# EAGLE design Color-LCD-Shield (EAGLE 6.5.0)
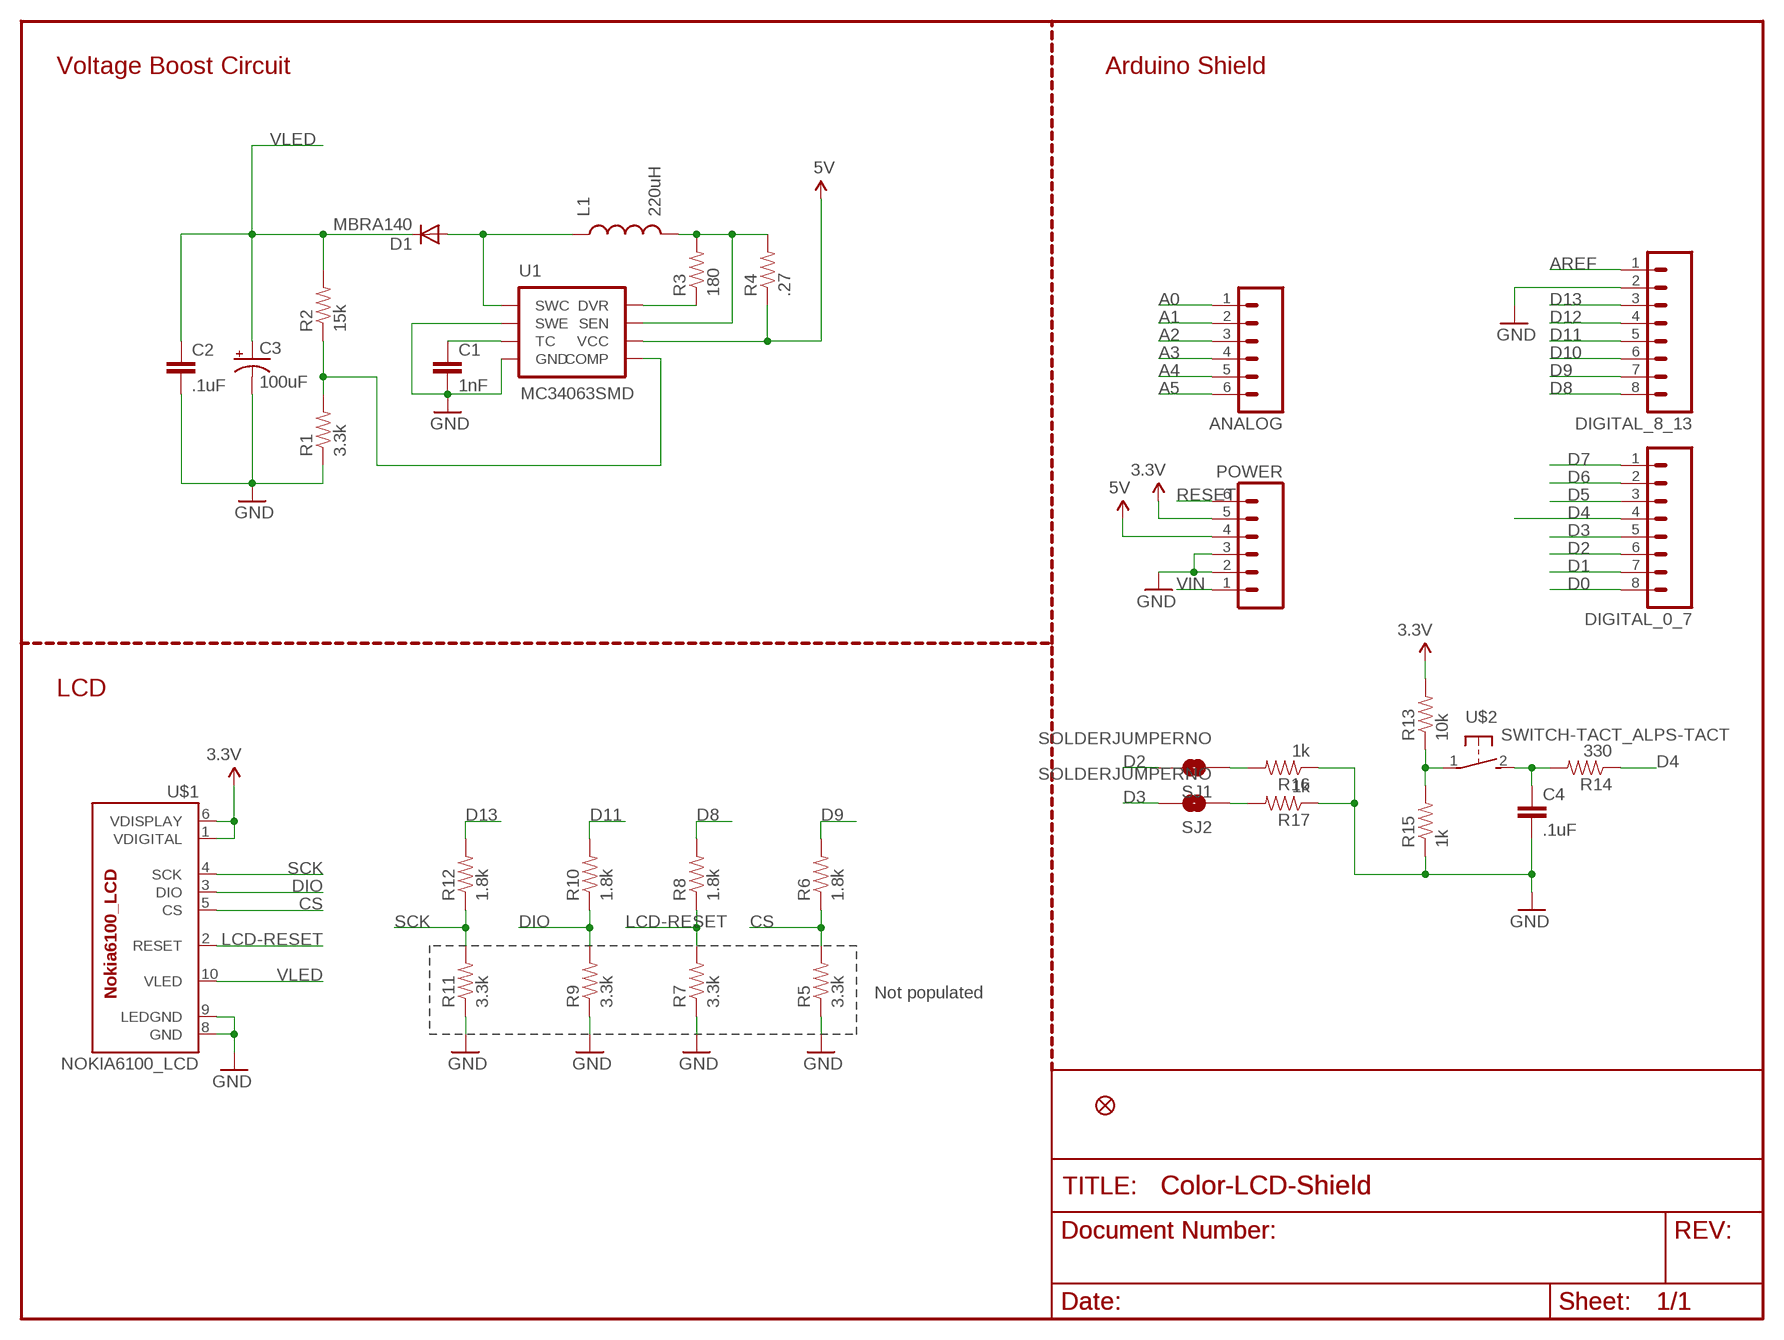
[diagram p0: schematic, sheet 1]

## Parts
ANALOG  M06SIP  [1X06]
C1  1nF  CAP0603-CAP  [0603-CAP]
C2  .1uF  CAP0603-CAP  [0603-CAP]
C3  100uF  CAP_POL7343  [EIA7343]
C4  .1uF  CAP0603-CAP  [0603-CAP]
D1  MBRA140  DIODESMA  [SMA-DIODE]
DIGITAL_0_7  M08  [1X08]
DIGITAL_8_13  M08  [1X08]
JP2  FIDUCIAL1X2  [FIDUCIAL-1X2]
L1  220uH  INDUCTORNPI75C  [NPI75C]
POWER  M06SIP  [1X06]
R1  3.3k  RESISTOR0603-RES  [0603-RES]
R2  15k  RESISTOR0603-RES  [0603-RES]
R3  180  RESISTOR0603-RES  [0603-RES]
R4  .27  RESISTOR0603-RES  [0603-RES]
R5  3.3k  RESISTOR0603-RES  [0603-RES]
R6  1.8k  RESISTOR0603-RES  [0603-RES]
R7  3.3k  RESISTOR0603-RES  [0603-RES]
R8  1.8k  RESISTOR0603-RES  [0603-RES]
R9  3.3k  RESISTOR0603-RES  [0603-RES]
R10  1.8k  RESISTOR0603-RES  [0603-RES]
R11  3.3k  RESISTOR0603-RES  [0603-RES]
R12  1.8k  RESISTOR0603-RES  [0603-RES]
R13  10k  RESISTOR0603-RES  [0603-RES]
R14  330  RESISTOR0603-RES  [0603-RES]
R15  1k  RESISTOR0603-RES  [0603-RES]
R16  1k  RESISTOR0603-RES  [0603-RES]
R17  1k  RESISTOR0603-RES  [0603-RES]
SJ1  SOLDERJUMPERNO  [SJ_2S-NO]
SJ2  SOLDERJUMPERNO  [SJ_2S-NO]
U1  MC34063SMD  [SO08]
U$1  NOKIA6100_LCD  [NOKIA6100_LCD]
U$2  SWITCH-TACT_ALPS-TACT  [SWITCH-TACT_DTS-6]

## Nets
3.3V: POWER.5 R13.2 U$1.1(VDIGITAL) U$1.6(VDISPLAY)
5V: POWER.4 R4.1 U1.6(VCC)
A0: ANALOG.1
A1: ANALOG.2
A2: ANALOG.3
A3: ANALOG.4
A4: ANALOG.5
A5: ANALOG.6
AREF: DIGITAL_8_13.1
CS: R5.2 R6.1 U$1.5(CS)
D0: DIGITAL_0_7.8
D1: DIGITAL_0_7.7
D2: DIGITAL_0_7.6 SJ1.2
D3: DIGITAL_0_7.5 SJ2.2
D4: DIGITAL_0_7.4 R14.1
D5: DIGITAL_0_7.3
D6: DIGITAL_0_7.2
D7: DIGITAL_0_7.1
D8: DIGITAL_8_13.8 R8.2
D9: DIGITAL_8_13.7 R6.2
D10: DIGITAL_8_13.6
D11: DIGITAL_8_13.5 R10.2
D12: DIGITAL_8_13.4
D13: DIGITAL_8_13.3 R12.2
DIO: R9.2 R10.1 U$1.3(DIO)
GND: C1.2 C2.2 C3.C(-) C4.2 DIGITAL_8_13.2 POWER.2 POWER.3 R1.1 R5.1 R7.1 R9.1 R11.1 R15.1 R16.1 R17.1 U1.2(SWE) U1.4(GND) U$1.8(GND) U$1.9(LEDGND)
LCD-RESET: R7.2 R8.1 U$1.2(RESET)
N$1: R13.1 R15.2 U$2.1
N$2: C4.1 R14.2 U$2.2
N$5: R17.2 SJ2.1
N$6: R16.2 SJ1.1
N$9: R1.2 R2.1 U1.5(COMP)
N$10: C1.1 U1.3(TC)
N$13: D1.A L1.1 U1.1(SWC)
N$14: R3.1 U1.8(DVR)
N$15: L1.2 R3.2 R4.2 U1.7(SEN)
RESET: POWER.6
SCK: R11.2 R12.1 U$1.4(SCK)
VIN: POWER.1
VLED: C2.1 C3.A(+) D1.C R2.2 U$1.10(VLED)

## Notes on the sheet
- Voltage Boost Circuit | Arduino Shield
- LCD
- Not populated

## Library data of the parts
ANALOG POWER = SparkFun:M06: Header 6 Standard 6-pin 0.1" header. Use with straight break away headers (SKU : PRT-00116), right angle break away headers (PRT-00553), swiss pins (PRT-00743), machine pins (PRT-00117), and female headers (PRT-00115). Molex polarized connector foot print use with SKU : PRT-08094 with associated crimp pins and housings. NOTES ON THE VARIANTS LOCK and LOCK_LONGPADS... This footprint was designed to help hold the alignment of a through-hole component (i.e. 6-pin header) while soldering it into place. You may notice that each hole has been shifted either up or down by 0.005 of an inch from it's more standard position (which is a perfectly straight line). This slight alteration caused the pins (the squares in the middle) to touch the edges of the holes. Because they are alternating, it causes a "brace" to hold the component in place. 0.005 has proven to be the perfect amount of "off-center" position when using our standard breakaway headers. Although looks a little odd when you look at the bare footprint, once you have a header in there, the alteration is very hard to notice. Also, if you push a header all the way into place, it is covered up entirely on the bottom side. This idea of altering the position of holes to aid alignment will be further integrated into the Sparkfun Library for other footprints. It can help hold any component with 3 or more connection pins.
C1 C2 C4 = SparkFun:CAP: Capacitor Standard 0603 ceramic capacitor, and 0.1" leaded capacitor.
C3 = SparkFun:CAP_POL: Capacitor Polarized These are standard SMD and PTH capacitors. Normally 10uF, 47uF, and 100uF in electrolytic and tantalum varieties. Always verify the external diameter of the through hole cap, it varies with capacity, voltage, and manufacturer. The EIA devices should be standard.
D1 = SparkFun:DIODE: Diode These are standard reverse protection diodes and small signal diodes. SMA package can handle up to about 1A. SOD-323 can handle about 200mA. What the SOD-323 package when ordering, there are some mfgs out there that are 5-pin packages.
DIGITAL_0_7 DIGITAL_8_13 = SparkFun:M08: Header 8 Standard 8-pin 0.1" header. Use with straight break away headers (SKU : PRT-00116), right angle break away headers (PRT-00553), swiss pins (PRT-00743), machine pins (PRT-00117), and female headers (PRT-00115).
JP2 = SparkFun:FIDUCIAL: Fiducial Alignment Points Various fiducial points for machine vision alignment.
L1 = SparkFun:INDUCTOR: Inductors Basic Inductor/Choke - 0603 and 1206. Footprints are not proven and vary greatly between part numbers.
R1-R17 = SparkFun:RESISTOR: Resistor Basic schematic elements and footprints for 0603, 1206, and PTH resistors.
SJ1 SJ2 = SparkFun-Passives:SOLDERJUMPER: Solder Jumper Standard SMD solder jumper. Used to automate production. Two varients : Normally Open and Normally Closed are the same, but have different paste layers. NC will have a large amount of paste and should jumper during reflow.
U1 = SparkFun:MC34063
U$1 = SparkFun:NOKIA6100_LCD: Nokia 6100 Color LCD Schematic element and footprint production proven but could use some touching up. Spark Fun Electronics SKU : LCD-00569. Mating SMD connector : LCD-00570
U$2 = Maple-mini-r2-evolution-board.td:SWITCH-TACT_ALPS-TACT

## Board
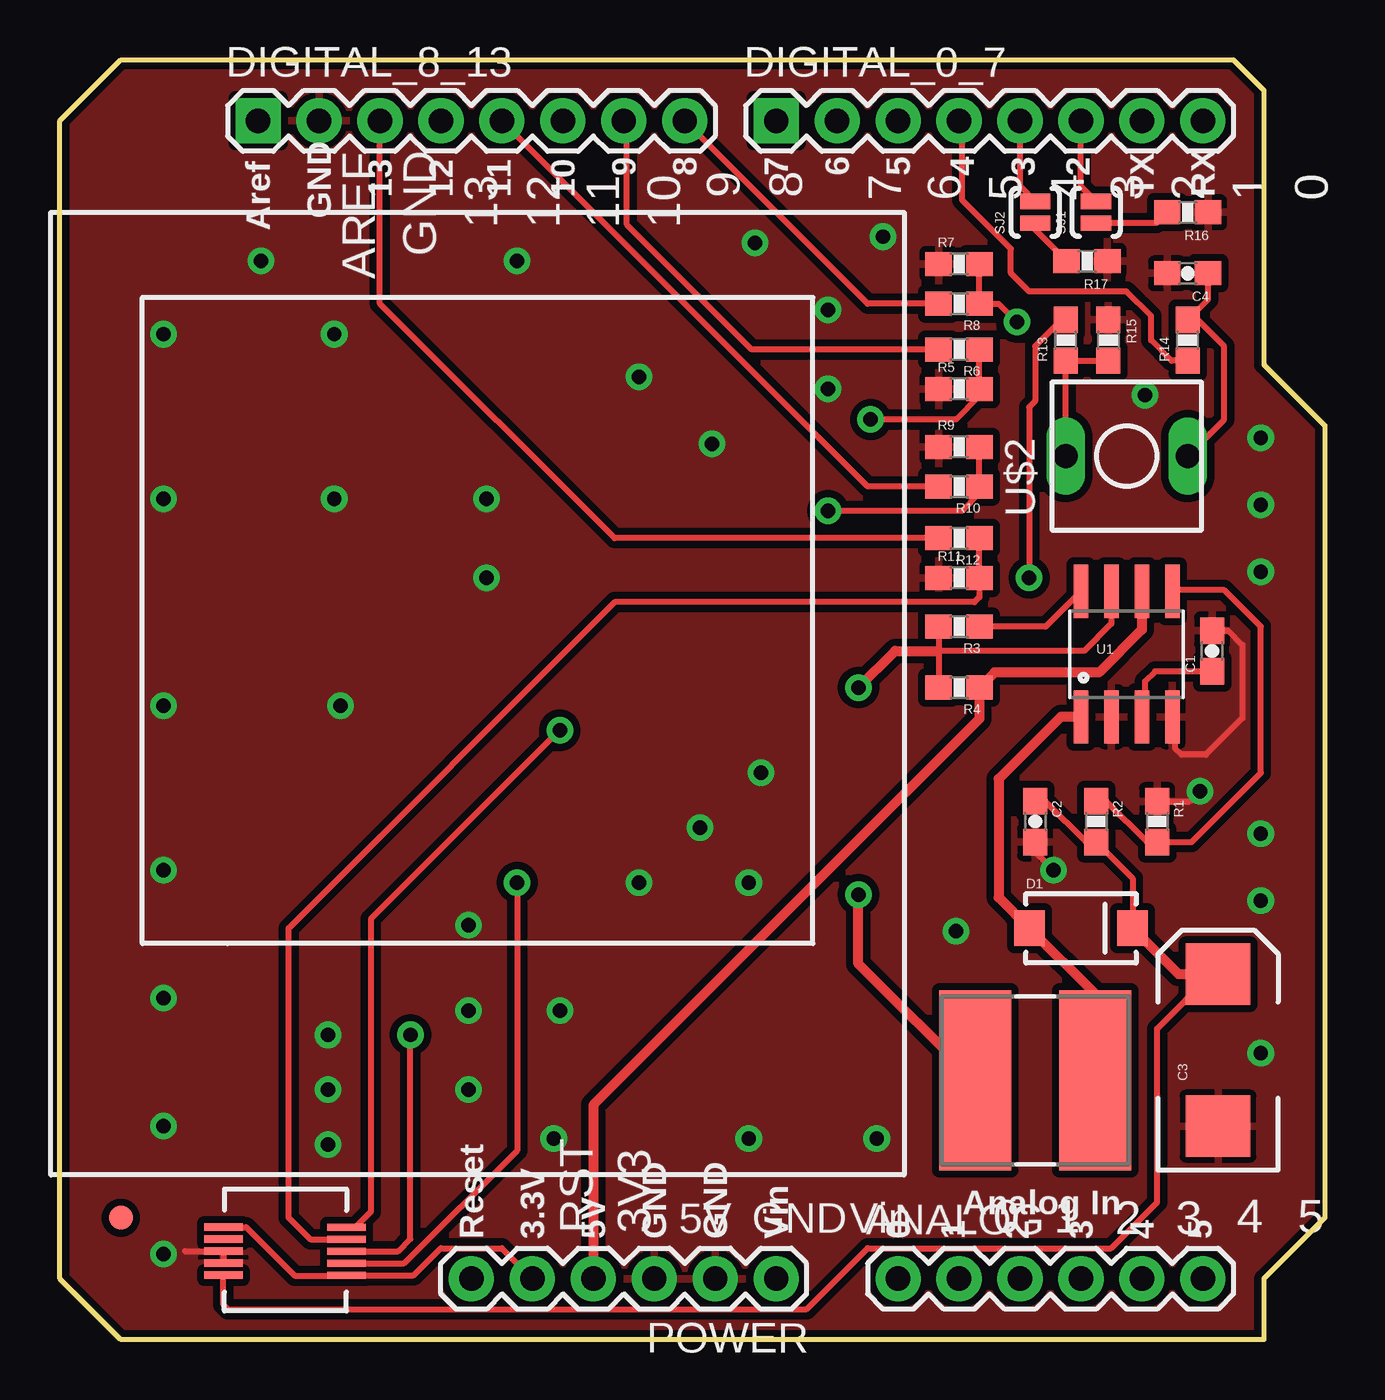
[diagram p1: board, top side]
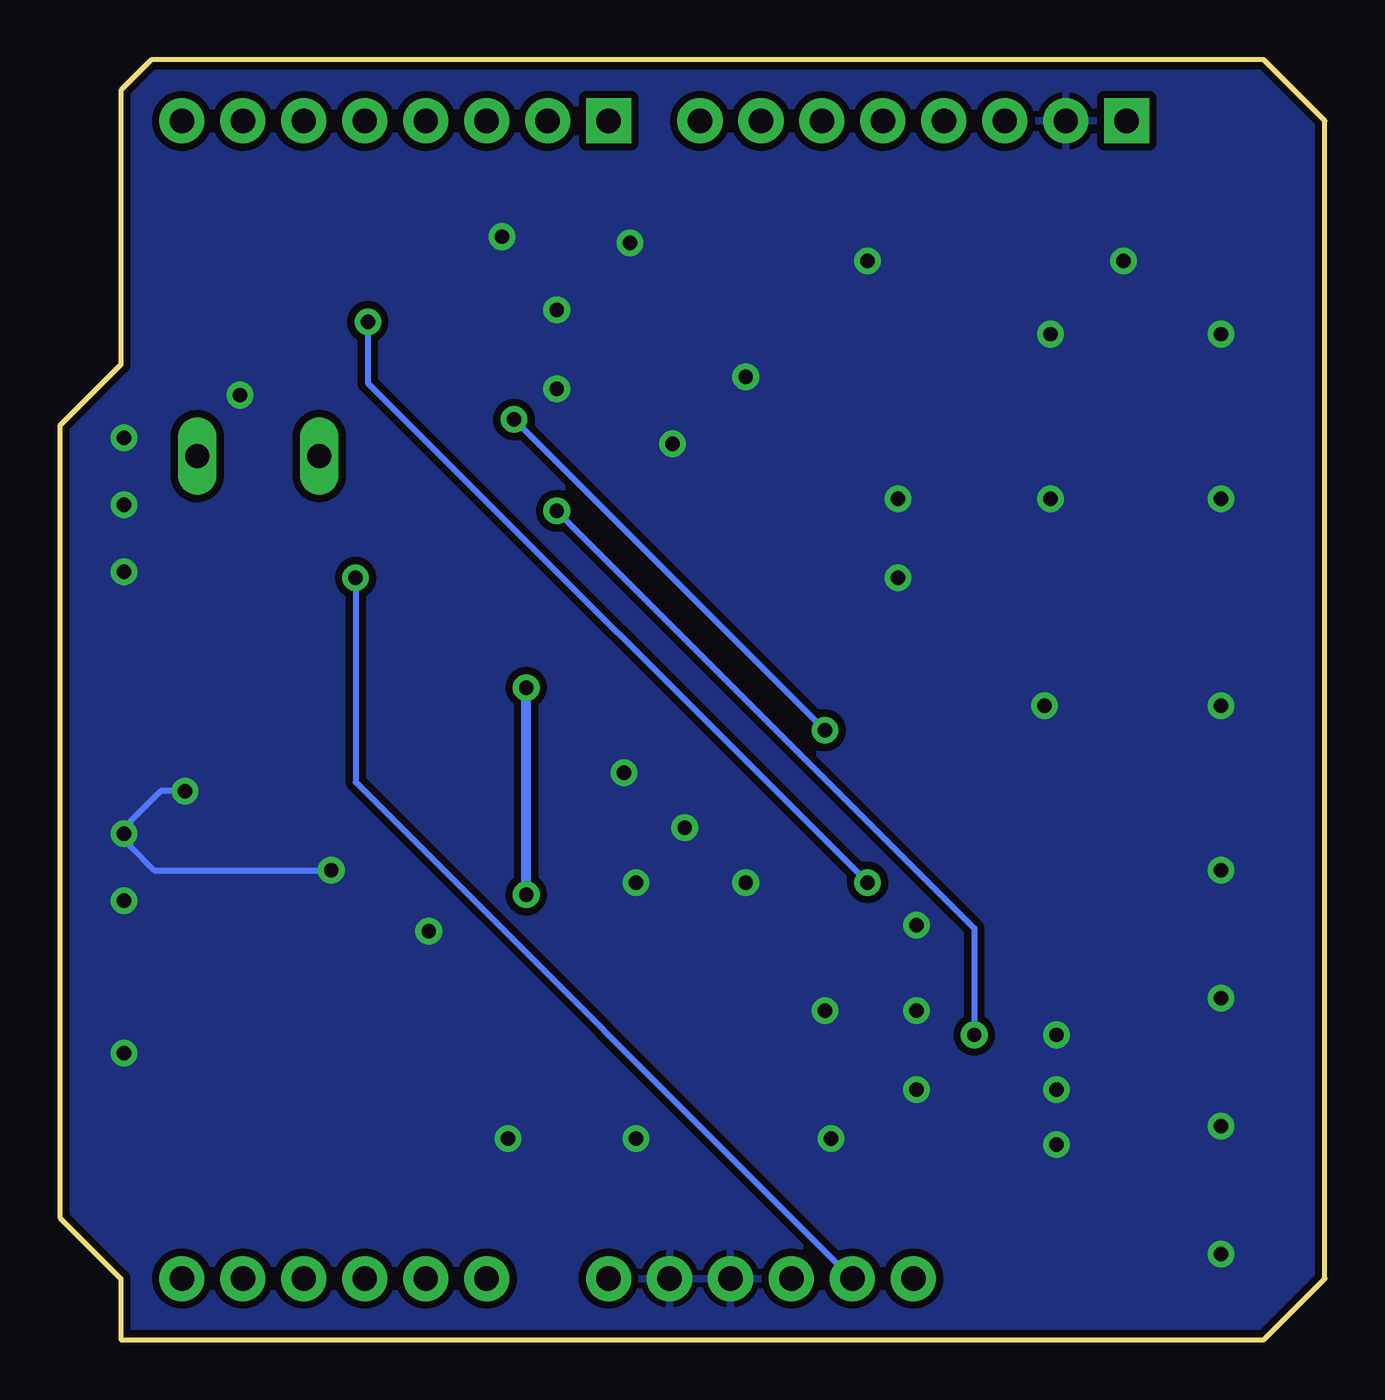
[diagram p2: board, bottom side, seen from below]

Size 52.7 x 53.34 mm. Coordinates in mm from the lower left corner, seen from the top.
Outline: 2.54,0 0,2.54 0,50.8 2.54,53.34 48.9,53.34 50.16,52.07 50.16,40.64 52.7,38.1 52.7,5.08 50.16,2.54 50.16,0 2.54,0
Copper layers (1*16): Top 0.035mm / dielectric 1.5mm / Bottom 0.035mm
Design rules "SparkFun-2-layer": minimum track width 7mil, minimum drill 15mil, track to track 8mil, track to pad 8mil, pad to pad 8mil, via to via 8mil, smd to smd 8mil, copper to edge 8mil, drill to drill 8mil, minimum pad ring 12mil, minimum via ring 10mil, stop-mask expansion 4mil, vias tented up to drill 20mil, thermal gap 10mil

### Footprints (pad centres in the part's own frame; a part is rotated, then mirrored left to right if it is on the bottom)
1X06 = drill 1.016 pad 1.88: 1 0,0; 2 2.54,0; 3 5.08,0; 4 7.62,0; 5 10.16,0; 6 12.7,0
0603-CAP = smd 1.1 x 1: 1 -0.85,0; 2 0.85,0
EIA7343 = smd 2.55 x 2.7: A 3.17,0; C -3.17,0
SMA-DIODE = smd 1.27 x 1.47: A -2.15,0; C 2.15,0
1X08 = drill 1.016 pad 1.88 square: 1 0,0 | drill 1.016 pad 1.88: 2 2.54,0; 3 5.08,0; 4 7.62,0; 5 10.16,0; 6 12.7,0; 7 15.24,0; 8 17.78,0
FIDUCIAL-1X2 = smd 1 x 1: 1 0,0
NPI75C = smd 3 x 7.5: 1 -2.5,0; 2 2.5,0
0603-RES = smd 1.1 x 1: 1 -0.85,0; 2 0.85,0
SJ_2S-NO = smd 0.635 x 1.27: 1 -0.45,0; 2 0.45,0
SO08 = smd 0.61 x 2.21: 1 -1.905,-2.616; 2 -0.635,-2.616; 3 0.635,-2.616; 4 1.905,-2.616; 5 1.905,2.616; 6 0.635,2.616; 7 -0.635,2.616; 8 -1.905,2.616
NOKIA6100_LCD = smd 1.6 x 0.3: 1 24.255,44.311; 2 24.255,43.811; 3 24.255,43.311; 4 24.255,42.811; 5 24.255,42.311; 6 29.389,42.303; 7 29.389,42.803; 8 29.389,43.303; 9 29.389,43.803; 10 29.389,44.303
SWITCH-TACT_DTS-6 = drill 1 long: 1 0,2.54; 2 0,-2.54

### Placement (x,y rotation side)
ANALOG  34.92,2.54 0 top
C1  48.01,28.7 90 top
C2  40.64,21.59 270 top
C3  48.26,12.06 90 top
C4  46.99,44.45 180 top
D1  42.55,17.14 0 top
DIGITAL_0_7  29.84,50.8 0 top
DIGITAL_8_13  8.26,50.8 0 top
JP2  2.54,5.08 0 top
L1  40.64,10.79 180 top
POWER  29.84,2.54 180 top
R1  45.72,21.59 270 top
R2  43.18,21.59 270 top
R3  37.47,29.72 180 top
R4  37.47,27.18 180 top
R5  37.47,39.62 0 top
R6  37.47,41.27 180 top
R7  37.47,44.83 0 top
R8  37.47,43.18 180 top
R9  37.47,37.21 0 top
R10  37.47,35.56 180 top
R11  37.47,31.75 0 top
R12  37.47,33.4 180 top
R13  41.91,41.66 90 top
R14  46.99,41.66 90 top
R15  43.69,41.66 270 top
R16  46.99,46.99 180 top
R17  42.8,44.96 180 top
SJ1  43.18,46.99 90 top
SJ2  40.64,46.99 90 top
U1  44.45,28.57 0 top
U$1  36.2,46.99 180 top
U$2  44.45,36.83 90 top

### Tracks (layer width: path | path; a pad name or v marks a point on that pad's centre or on a via)
3.3V  (via drill 0.6 pad 0.25)
  Top 0.254: U$1.6 7.76,4.69 9.78,2.67 11.43,2.67 11.44,2.68 U$1.1 14.74,2.68 15.88,3.81 18.41,3.81 POWER.5 | R13.2 41.74,42.51 40.64,41.4 40.64,39.12 40.39,38.86 v40.39,31.75
  Bottom 0.254: v40.39,31.75 40.39,23.24 POWER.5
5V
  Top 0.406: U1.6 45.09,29.59 43.31,27.81 38.95,27.81 R4.1 38.31,25.87 22.23,9.78 POWER.4
CS  (via drill 0.6 pad 0.25)
  Top 0.254: R6.1 R5.2 38.31,39.33 37.34,38.35 v33.78,38.35 | v20.83,25.4 12.95,17.53 12.95,5.33 12.3,4.68 U$1.5
  Bottom 0.254: v33.78,38.35 v20.83,25.4
D2
  Top 0.254: SJ1.2 42.55,48.08 DIGITAL_0_7.6
D3
  Top 0.254: SJ2.2 40.01,48.08 DIGITAL_0_7.5
D4
  Top 0.254: R14.1 46.32,40.81 45.47,41.66 45.47,42.67 44.45,43.69 40.39,43.69 39.62,44.45 39.62,45.47 37.59,47.5 37.59,50.67 DIGITAL_0_7.4
D8
  Top 0.254: R8.2 33.66,43.18 DIGITAL_8_13.8
D9
  Top 0.254: R6.2 28.83,41.27 23.62,46.48 23.62,50.67 DIGITAL_8_13.7
D11
  Top 0.254: R10.2 33.66,35.56 DIGITAL_8_13.5
D13
  Top 0.254: R12.2 23.11,33.4 13.34,43.18 DIGITAL_8_13.3
DIO  (via drill 0.6, 0.6 pad 0.25)
  Top 0.254: U$1.3 14.09,3.68 14.61,4.19 v14.61,12.7 | R9.2 R10.1 38.31,35.27 37.59,34.54 v32,34.54
  Bottom 0.254: v32,34.54 14.61,17.14 v14.61,12.7
GND  (via drill 0.6)
  Top 0.254: 5.21,3.68 5.21,3.69 U$1.8 U$1.9 | C1.2 48.68,29.55 49.28,28.96 49.28,25.91 47.75,24.38 46.74,24.38 46.48,24.64 46.48,25.83 U1.4 | R1.1 47.08,22.44 v47.5,22.86 | v41.4,19.56 40.64,20.32 C2.2
  Bottom 0.254: v47.5,22.86 48.51,22.86 49.78,21.59 49.78,20.57 48.77,19.56 v41.4,19.56
  other vias: 24.13,40.13 32,42.93 28.96,45.72 34.29,45.97 19.05,44.96 8.38,44.96 4.32,3.56 4.32,8.89 4.32,14.22 4.32,19.56 4.32,26.42 4.32,35.05 4.32,41.91 32,39.62 50.04,37.59 50.04,34.8 50.04,32 50.04,21.08 50.04,18.29 50.04,11.94 37.34,17.02 34.04,8.38 28.7,8.38 20.57,8.38 17.02,17.27 17.02,13.72 17.02,10.41 28.7,19.05 24.13,19.05 29.21,23.62 26.67,21.34 20.83,13.72 11.18,12.7 11.18,10.41 11.18,8.13 11.68,26.42 11.43,35.05 11.43,41.91 27.18,37.34 17.78,35.05 17.78,31.75 45.21,39.37
  pour Top (isolate 0.305): 2.54,0 0,2.54 0,50.8 2.54,53.34 48.9,53.34 50.16,52.07 50.16,40.64 52.7,38.1 52.7,5.08 50.16,2.54 50.16,0
  pour Bottom (isolate 0.305): 0,50.8 2.54,53.34 48.9,53.34 50.16,52.07 50.16,40.64 52.7,38.1 52.7,5.08 50.16,2.54 50.16,0 2.54,0 0,2.54
LCD-RESET  (via drill 0.6 pad 0.25)
  Top 0.254: R7.2 R8.1 39.12,43.18 v39.88,42.42 | v19.05,19.05 19.05,7.87 14.36,3.18 U$1.2
  Bottom 0.254: v39.88,42.42 39.88,39.88 v19.05,19.05
N$1
  Top 0.254: U$2.1 R13.1 R15.2
N$2
  Top 0.254: U$2.2 48.51,38.35 48.51,41.4 47.41,42.51 R14.2 47.84,43.36 C4.1
N$5
  Top 0.254: R17.2 40.64,46.27 SJ2.1
N$6
  Top 0.254: R16.2 45.69,46.54 SJ1.1
N$9
  Top 0.254: R2.1 43.6,22.44 45.3,20.74 R1.2 47.16,20.74 50.04,23.62 50.04,29.72 48.51,31.24 46.41,31.24 U1.5
N$10
  Top 0.254: C1.1 45.63,27.85 45.21,27.43 45.21,26.09 U1.3
N$13
  Top 0.406: U1.1 41.71,25.96 39.12,23.37 39.12,18.42 D1.A 43.14,14.4 L1.1
N$14
  Top 0.254: U1.8 41.07,29.72 R3.1
N$15  (via drill 0.6 pad 0.25)
  Top 0.254: R3.2 36.62,28.7 | 36.62,28.7 R4.2 | U1.7 43.81,29.84 42.67,28.7 36.62,28.7
  Top 0.406: L1.2 33.27,15.66 v33.27,18.54 | v33.27,27.18 34.8,28.7 36.62,28.7
  Bottom 0.406: v33.27,18.54 v33.27,27.18
SCK
  Top 0.254: U$1.4 10.43,4.18 9.53,5.08 9.53,17.14 23.11,30.73 38.1,30.73 38.31,30.95 R11.2 R12.1
VLED
  Top 0.254: U$1.10 6.81,1.45 6.99,1.27 31.11,1.27 33.66,3.81 43.81,3.81 45.72,5.71 45.72,12.95 48,15.23 | C2.1 41.06,22.44 42.76,20.74 R2.2 44.7,19.23 D1.C
  Top 0.406: D1.C 46.6,15.23 C3.A 48,15.23

### Text on the board
tPlace: 9 | 8 | 7 | 6 | 5 | 4 | 3 | 2 | 13 | 12 | 11 | 10 | TX | RX | GND | Aref | Analog In | Reset | 3.3V | 5V | GND | GND | Vin | 0 | 1 | 2 | 3 | 4 | 5
tNames: 9 | 8 | 7 | 6 | 5 | 4 | 3 | 2 | 1 | 0 | 13 | 12 | 11 | 10 | GND | AREF | RST | 3V3 | 5V | GND | Vin | 0 | 1 | 2 | 3 | 4 | 5